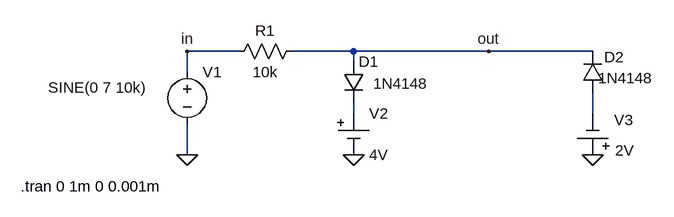
[diagram p0: schematic clipper.asc]
clipper.asc, the LTspice schematic file:
Version 4
SHEET 1 880 680
WIRE 176 96 96 96
WIRE 352 96 256 96
WIRE 560 96 352 96
WIRE 720 96 560 96
WIRE 352 112 352 96
WIRE 96 128 96 96
WIRE 352 192 352 176
WIRE 720 192 720 160
WIRE 96 256 96 208
FLAG 96 256 0
FLAG 352 256 0
FLAG 560 96 out
FLAG 96 96 in
FLAG 720 256 0
SYMBOL diode 336 112 R0
WINDOW 3 46 34 Left 2
SYMATTR InstName D1
SYMATTR Value 1N4148
SYMBOL res 272 80 R90
WINDOW 0 0 56 VBottom 2
WINDOW 3 32 56 VTop 2
SYMATTR InstName R1
SYMATTR Value 10k
SYMBOL voltage 96 112 R0
WINDOW 3 -214 40 Left 2
WINDOW 123 0 0 Left 0
WINDOW 39 0 0 Left 0
SYMATTR Value SINE(0 7 10k)
SYMATTR InstName V1
SYMBOL Misc\\cell 352 192 R0
WINDOW 123 0 0 Left 0
WINDOW 39 0 0 Left 0
SYMATTR InstName V2
SYMATTR Value 4V
SYMBOL Misc\\cell 720 256 R180
WINDOW 123 0 0 Left 0
WINDOW 39 0 0 Left 0
WINDOW 0 -62 54 Left 2
WINDOW 3 -64 7 Left 2
SYMATTR InstName V3
SYMATTR Value 2V
SYMBOL diode 736 160 R180
WINDOW 0 -32 55 Left 2
WINDOW 3 -77 23 Left 2
SYMATTR InstName D2
SYMATTR Value 1N4148
TEXT -160 304 Left 2 !.tran 0 1m 0 0.001m

The netlist it stands for:
* clipper.asc
D1 out N001 1N4148
R1 out in 10k
V1 in 0 SINE(0 7 10k)
V2 N001 0 4V
V3 0 N002 2V
D2 N002 out 1N4148
.model D D
.lib standard.dio
.tran 0 1m 0 0.001m
.backanno
.end